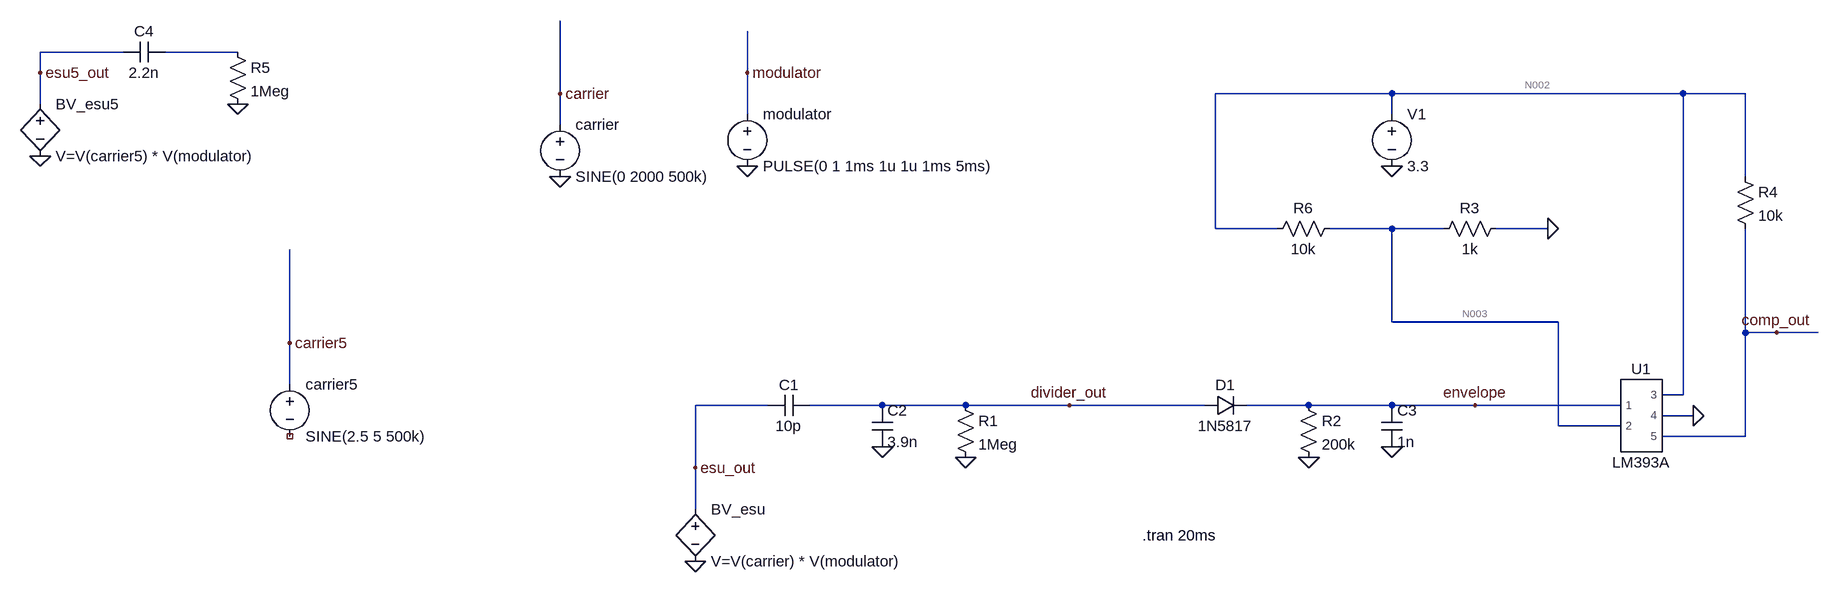
[diagram p0: schematic ECU_monitor.asc]
ECU_monitor.asc, the LTspice schematic file:
Version 4.1
SHEET 1 1636 1044
WIRE -1088 96 -1216 96
WIRE -912 96 -1024 96
WIRE -1216 128 -1216 96
WIRE -128 128 -128 64
WIRE -416 160 -416 48
WIRE 864 160 592 160
WIRE 1312 160 864 160
WIRE 1408 160 1312 160
WIRE -1216 176 -1216 128
WIRE -128 192 -128 128
WIRE 864 192 864 160
WIRE -416 208 -416 160
WIRE 1408 288 1408 160
WIRE 592 368 592 160
WIRE 688 368 592 368
WIRE 864 368 768 368
WIRE 944 368 864 368
WIRE 1104 368 1024 368
WIRE 864 512 864 368
WIRE 1120 512 864 512
WIRE 1408 528 1408 368
WIRE 1456 528 1408 528
WIRE 1520 528 1456 528
WIRE -832 544 -832 400
WIRE -832 608 -832 544
WIRE 1312 624 1312 160
WIRE 1312 624 1280 624
WIRE -96 640 -208 640
WIRE 80 640 -32 640
WIRE 208 640 80 640
WIRE 368 640 208 640
WIRE 576 640 368 640
WIRE 736 640 640 640
WIRE 864 640 736 640
WIRE 992 640 864 640
WIRE 1216 640 992 640
WIRE 1328 656 1280 656
WIRE 1120 672 1120 512
WIRE 1216 672 1120 672
WIRE 1408 688 1408 528
WIRE 1408 688 1280 688
WIRE -208 736 -208 640
WIRE -208 800 -208 736
FLAG -128 272 0
FLAG -416 288 0
FLAG -128 128 modulator
FLAG -416 160 carrier
FLAG -208 736 esu_out
FLAG 80 704 0
FLAG 208 720 0
FLAG 368 640 divider_out
FLAG 992 640 envelope
FLAG 736 720 0
FLAG 864 704 0
FLAG 864 272 0
FLAG 1456 528 comp_out
FLAG -208 880 0
FLAG 1104 368 0
FLAG 1328 656 0
FLAG -832 544 carrier5
FLAG -912 176 0
FLAG -1216 256 0
FLAG -1216 128 esu5_out
SYMBOL voltage -128 176 R0
WINDOW 123 0 0 Left 0
WINDOW 39 0 0 Left 0
SYMATTR InstName modulator
SYMATTR Value PULSE(0 1 1ms 1u 1u 1ms 5ms)
SYMBOL voltage -416 192 R0
WINDOW 123 0 0 Left 0
WINDOW 39 0 0 Left 0
SYMATTR InstName carrier
SYMATTR Value SINE(0 2000 500k)
SYMBOL bv -208 784 R0
SYMATTR InstName BV_esu
SYMATTR Value V=V(carrier) * V(modulator)
SYMBOL cap -96 624 M90
WINDOW 0 0 32 VBottom 2
WINDOW 3 32 32 VTop 2
SYMATTR InstName C1
SYMATTR Value 10p
SYMBOL cap 64 640 R0
SYMATTR InstName C2
SYMATTR Value 3.9n
SYMBOL res 192 624 R0
SYMATTR InstName R1
SYMATTR Value 1Meg
SYMBOL diode 576 656 R270
WINDOW 0 32 32 VTop 2
WINDOW 3 0 32 VBottom 2
SYMATTR InstName D1
SYMATTR Value 1N5817
SYMBOL res 720 624 R0
SYMATTR InstName R2
SYMATTR Value 200k
SYMBOL cap 848 640 R0
SYMATTR InstName C3
SYMATTR Value 1n
SYMBOL voltage 864 176 R0
WINDOW 123 0 0 Left 0
WINDOW 39 0 0 Left 0
SYMATTR InstName V1
SYMATTR Value 3.3
SYMBOL res 784 352 R90
WINDOW 0 0 56 VBottom 2
WINDOW 3 32 56 VTop 2
SYMATTR InstName R6
SYMATTR Value 10k
SYMBOL res 1040 352 R90
WINDOW 0 0 56 VBottom 2
WINDOW 3 32 56 VTop 2
SYMATTR InstName R3
SYMATTR Value 1k
SYMBOL res 1392 272 R0
SYMATTR InstName R4
SYMATTR Value 10k
SYMBOL LM393A 1248 656 R0
SYMATTR InstName U1
SYMBOL voltage -832 592 R0
WINDOW 123 0 0 Left 0
WINDOW 39 0 0 Left 0
SYMATTR InstName carrier5
SYMATTR Value SINE(2.5 5 500k)
SYMBOL bv -1216 160 R0
SYMATTR InstName BV_esu5
SYMATTR Value V=V(carrier5) * V(modulator)
SYMBOL res -928 80 R0
SYMATTR InstName R5
SYMATTR Value 1Meg
SYMBOL cap -1024 80 R90
WINDOW 0 0 32 VBottom 2
WINDOW 3 32 32 VTop 2
SYMATTR InstName C4
SYMATTR Value 2.2n
TEXT 480 840 Left 2 !.tran 20ms

The netlist it stands for:
* ECU_monitor.asc
V§modulator modulator 0 PULSE(0 1 1ms 1u 1u 1ms 5ms)
V§carrier carrier 0 SINE(0 2000 500k)
BV_esu esu_out 0 V=V(carrier) * V(modulator)
C1 esu_out divider_out 10p
C2 divider_out 0 3.9n
R1 divider_out 0 1Meg
D1 divider_out envelope 1N5817
R2 envelope 0 200k
C3 envelope 0 1n
V1 N002 0 3.3
R6 N003 N002 10k
R3 0 N003 1k
R4 N002 comp_out 10k
X§U1 envelope N003 N002 0 comp_out LM393A  ; pins 1 2 3 4 5
V§carrier5 carrier5 NC_01 SINE(2.5 5 500k)
BV_esu5 esu5_out 0 V=V(carrier5) * V(modulator)
R5 N001 0 1Meg
C4 N001 esu5_out 2.2n
.model D D
.lib standard.dio
.tran 20ms
.lib D:\Downloads\slcj017\LM393A.5_1
.backanno
.end

* Results of the author's LTspice run, read from the files saved beside the schematic
* Operating Point, zero values left out:
*   V(carrier5) = 2.5 V
*   V(comp_out) = 42.94 mV
*   V(divider_out) = 8.321 mV
*   V(envelope) = 8.331 mV
*   V(n002) = 3.3 V
*   V(n003) = 300 mV
*   I(D1) = -8.321 nA
*   I(R1) = 8.321 nA
*   I(R2) = 41.65 nA
*   I(R3) = -300 µA
*   I(R4) = 325.7 µA
*   I(R6) = -300 µA
*   I(V1) = -697 µA
*   Ix(u1:1) = -49.97 nA
*   Ix(u1:3) = 71.33 µA
*   Ix(u1:4) = -397 µA
*   Ix(u1:5) = 325.7 µA